# Altium project DoorController.PrjPCB
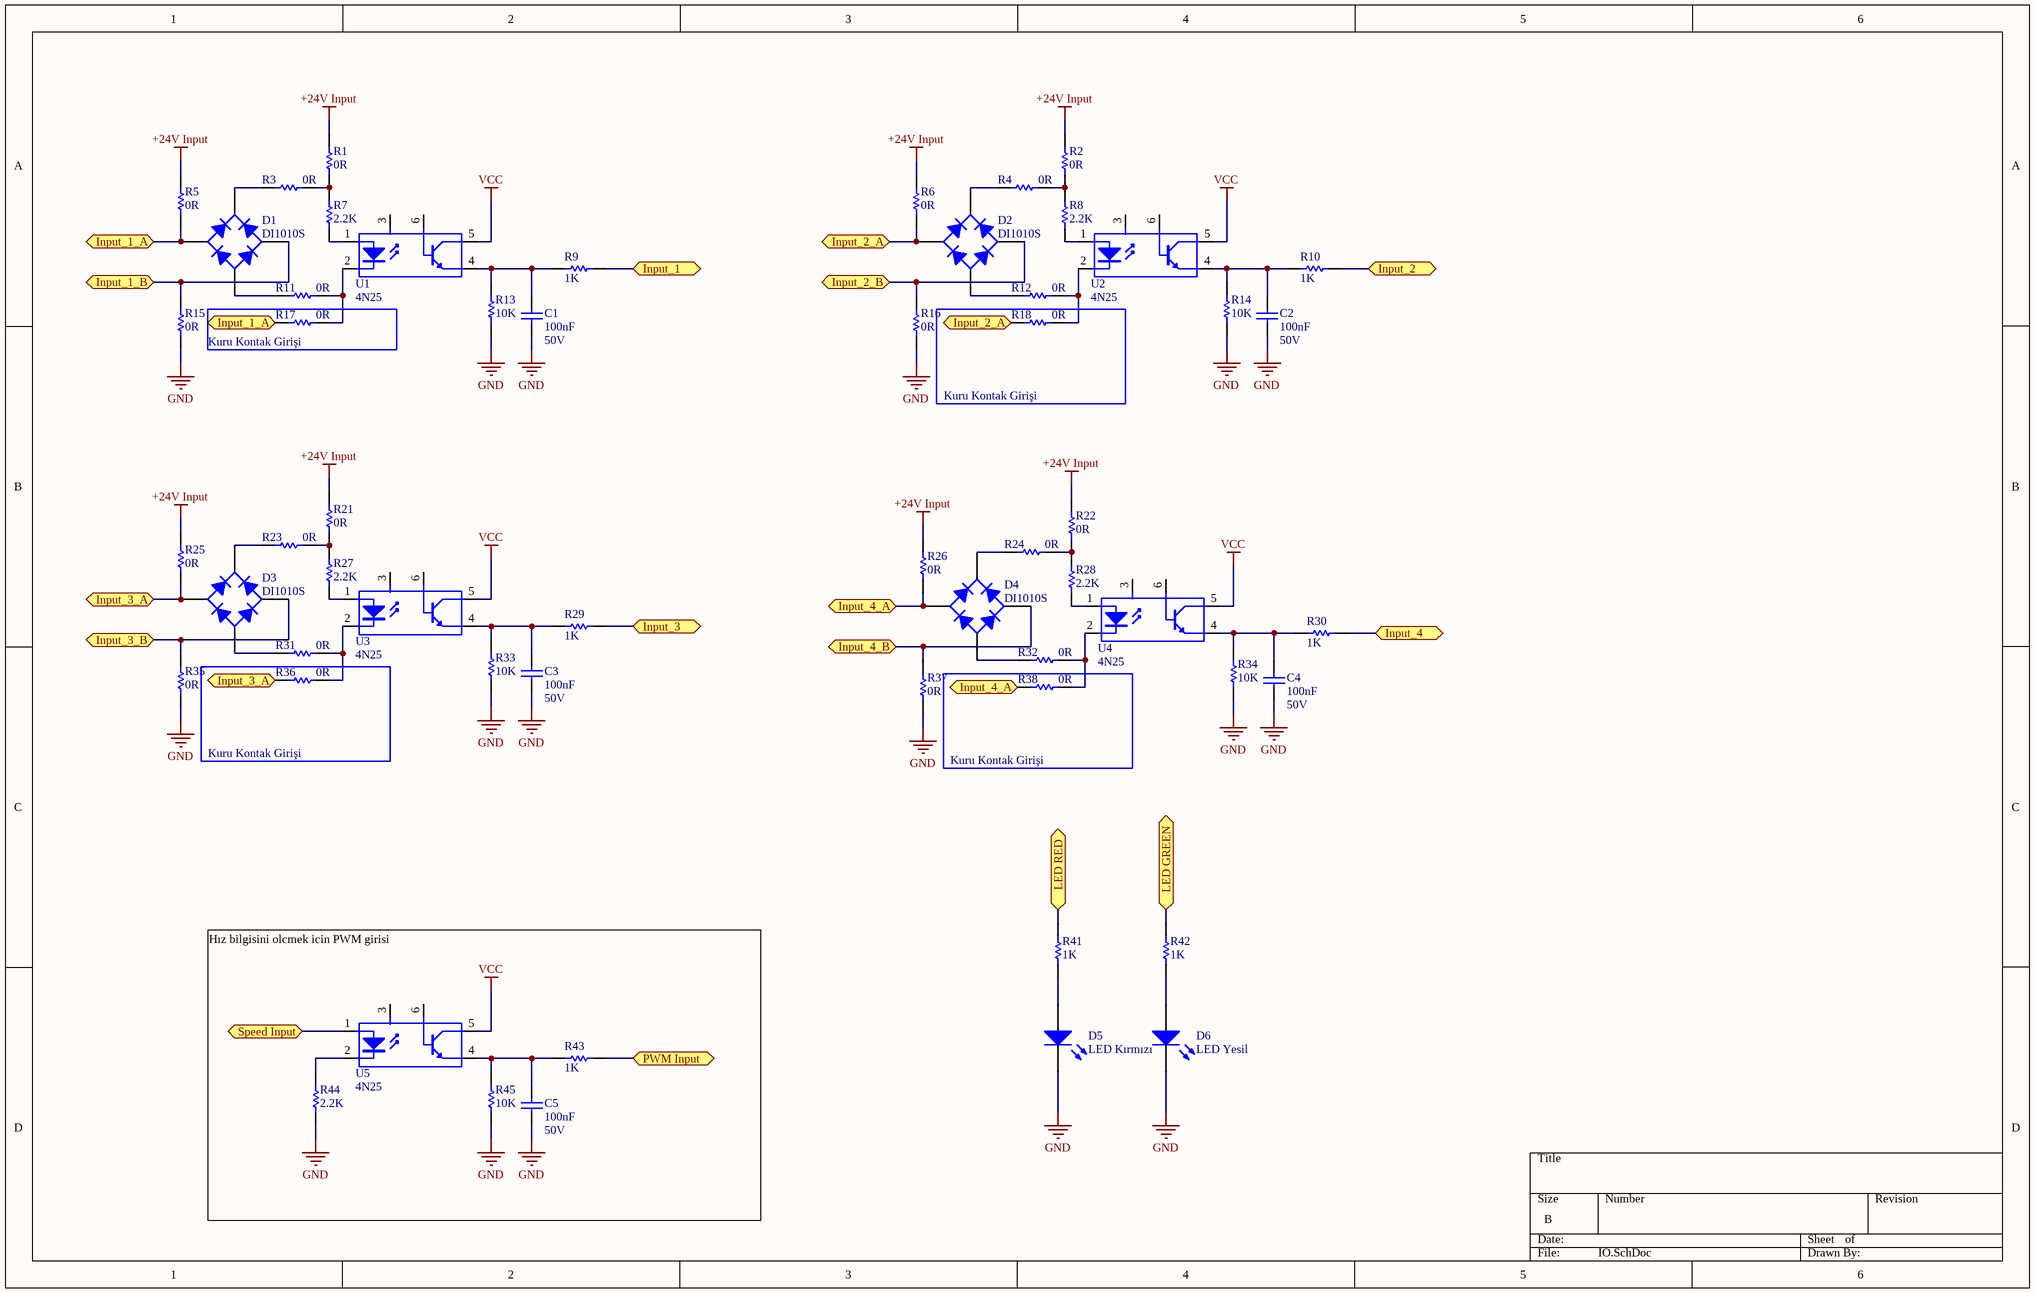
[diagram p0: IO.SchDoc]
4 sheets, 80 parts. Net scope: flat (ports and power ports of the same name join across sheets).
Board file: DoorController_DM-045_V03.PcbDoc
Sheets:
  IO.SchDoc
  Main.SchDoc
  POWER.SchDoc
  USART.SchDoc

## Sheet IO.SchDoc
size B

### Parts
C1  value 100nF  Voltage: 50V  [3-0603_L]  (hidden comment: Cap)
C2  value 100nF  Voltage: 50V  [3-0603_L]  (hidden comment: Cap)
C3  value 100nF  Voltage: 50V  [3-0603_L]  (hidden comment: Cap)
C4  value 100nF  Voltage: 50V  [3-0603_L]  (hidden comment: Cap)
C5  value 100nF  Voltage: 50V  [3-0603_L]  (hidden comment: Cap)
D1  DI1010S  [DF-S]
D2  DI1010S  [DF-S]
D3  DI1010S  [DF-S]
D4  DI1010S  [DF-S]
D5  LED Kırmızı  [6-0805 - LED]
D6  LED Yesil  [6-0805 - LED]
R1  value 0R  [6-0805_M]  (hidden comment: Res1)
R2  value 0R  [6-0805_M]  (hidden comment: Res1)
R3  value 0R  [6-0805_M]  (hidden comment: Res1)
R4  value 0R  [6-0805_M]  (hidden comment: Res1)
R5  value 0R  [6-0805_M]  (hidden comment: Res1)
R6  value 0R  [6-0805_M]  (hidden comment: Res1)
R7  value 2.2K  [6-0805_M]  (hidden comment: Res1)
R8  value 2.2K  [6-0805_M]  (hidden comment: Res1)
R9  value 1K  [3-0603_L]  (hidden comment: Res1)
R10  value 1K  [3-0603_L]  (hidden comment: Res1)
R11  value 0R  [6-0805_M]  (hidden comment: Res1)
R12  value 0R  [6-0805_M]  (hidden comment: Res1)
R13  value 10K  [3-0603_L]  (hidden comment: Res1)
R14  value 10K  [3-0603_L]  (hidden comment: Res1)
R15  value 0R  [6-0805_M]  (hidden comment: Res1)
R16  value 0R  [6-0805_M]  (hidden comment: Res1)
R17  value 0R  [6-0805_M]  (hidden comment: Res1)
R18  value 0R  [6-0805_M]  (hidden comment: Res1)
R21  value 0R  [6-0805_M]  (hidden comment: Res1)
R22  value 0R  [6-0805_M]  (hidden comment: Res1)
R23  value 0R  [6-0805_M]  (hidden comment: Res1)
R24  value 0R  [6-0805_M]  (hidden comment: Res1)
R25  value 0R  [6-0805_M]  (hidden comment: Res1)
R26  value 0R  [6-0805_M]  (hidden comment: Res1)
R27  value 2.2K  [6-0805_M]  (hidden comment: Res1)
R28  value 2.2K  [6-0805_M]  (hidden comment: Res1)
R29  value 1K  [3-0603_L]  (hidden comment: Res1)
R30  value 1K  [3-0603_L]  (hidden comment: Res1)
R31  value 0R  [6-0805_M]  (hidden comment: Res1)
R32  value 0R  [6-0805_M]  (hidden comment: Res1)
R33  value 10K  [3-0603_L]  (hidden comment: Res1)
R34  value 10K  [3-0603_L]  (hidden comment: Res1)
R35  value 0R  [6-0805_M]  (hidden comment: Res1)
R36  value 0R  [6-0805_M]  (hidden comment: Res1)
R37  value 0R  [6-0805_M]  (hidden comment: Res1)
R38  value 0R  [6-0805_M]  (hidden comment: Res1)
R41  value 1K  [3-0603_L]  (hidden comment: Res1)
R42  value 1K  [3-0603_L]  (hidden comment: Res1)
R43  value 1K  [3-0603_L]  (hidden comment: Res1)
R44  value 2.2K  [6-0805_M]  (hidden comment: Res1)
R45  value 10K  [3-0603_L]  (hidden comment: Res1)
U1  4N25  [DIP-6]
U2  4N25  [DIP-6]
U3  4N25  [DIP-6]
U4  4N25  [DIP-6]
U5  4N25  [DIP-6]

### Blocks framed on the sheet
Kuru Kontak Girişi: R17
Kuru Kontak Girişi: R18
Kuru Kontak Girişi: R36
Kuru Kontak Girişi: R38

### Ports
Input_1, Input_1_A, Input_1_B, Input_2, Input_2_A, Input_2_B, Input_3, Input_3_A, Input_3_B, Input_4, Input_4_A, Input_4_B, LED GREEN (bidir), LED RED (bidir), PWM Input, Speed Input

### Nets
+24V Input: R1.2 R2.2 R5.2 R6.2 R21.2 R22.2 R25.2 R26.2
GND: C1.2 C2.2 C3.2 C4.2 C5.2 D5.2(K) D6.2(K) R13.1 R14.1 R15.1 R16.1 R33.1 R34.1 R35.1 R37.1 R44.1 R45.1
VCC: U1.5(C) U2.5(C) U3.5(C) U4.5(C) U5.5(C)
NetC1_1: C1.1 R9.1 R13.2 U1.4(E)
NetC2_1: C2.1 R10.1 R14.2 U2.4(E)
NetC3_1: C3.1 R29.1 R33.2 U3.4(E)
NetC4_1: C4.1 R30.1 R34.2 U4.4(E)
NetC5_1: C5.1 R43.1 R45.2 U5.4(E)
NetD1_1: D1.1(A) R11.2
NetD1_2: D1.2(C) R5.1 R17.2 ; port Input_1_A
NetD1_3: D1.3(K) R3.2
NetD1_4: D1.4(C) R15.2 ; port Input_1_B
NetD2_1: D2.1(A) R12.2
NetD2_2: D2.2(C) R6.1 R18.2 ; port Input_2_A
NetD2_3: D2.3(K) R4.2
NetD2_4: D2.4(C) R16.2 ; port Input_2_B
NetD3_1: D3.1(A) R31.2
NetD3_2: D3.2(C) R25.1 R36.2 ; port Input_3_A
NetD3_3: D3.3(K) R23.2
NetD3_4: D3.4(C) R35.2 ; port Input_3_B
NetD4_1: D4.1(A) R32.2
NetD4_2: D4.2(C) R26.1 R38.2 ; port Input_4_A
NetD4_3: D4.3(K) R24.2
NetD4_4: D4.4(C) R37.2 ; port Input_4_B
NetD5_1: D5.1(A) R41.1
NetD6_1: D6.1(A) R42.1
NetR1_1: R1.1 R3.1 R7.1
NetR2_1: R2.1 R4.1 R8.1
NetR7_2: R7.2 U1.1(A)
NetR8_2: R8.2 U2.1(A)
NetR9_2: R9.2 ; port Input_1
NetR10_2: R10.2 ; port Input_2
NetR11_1: R11.1 R17.1 U1.2(K)
NetR12_1: R12.1 R18.1 U2.2(K)
NetR21_1: R21.1 R23.1 R27.1
NetR22_1: R22.1 R24.1 R28.1
NetR27_2: R27.2 U3.1(A)
NetR28_2: R28.2 U4.1(A)
NetR29_2: R29.2 ; port Input_3
NetR30_2: R30.2 ; port Input_4
NetR31_1: R31.1 R36.1 U3.2(K)
NetR32_1: R32.1 R38.1 U4.2(K)
NetR41_2: R41.2 ; port LED RED
NetR42_2: R42.2 ; port LED GREEN
NetR43_2: R43.2 ; port PWM Input
NetR44_2: R44.2 U5.2(K)
NetU5_1: U5.1(A) ; port Speed Input

Not connected (* = marked no-connect by the designer): U1 3(NC) 6(B); U2 3(NC) 6(B); U3 3(NC) 6(B); U4 3(NC) 6(B); U5 3(NC) 6(B)

### Notes on the sheet
- Hız bilgisini olcmek icin PWM girisi

### Library data of the parts
C1-C5 = Cap: Capacitor; Published: 8-Jun-2000; Revision: July-2002: Re-released for DXP Platform.; Publisher: Altium Limited
D1-D4 = DI1010S: Full Wave Diode Bridge; Published: 8-Jun-2000; Revision: July-2002: Re-released for DXP Platform.; Publisher: Altium Limited
D5 D6 = LED: Typical INFRARED GaAs LED; Published: 8-Jun-2000; LatestRevisionDate: 08-Jul-2005; LatestRevisionNote: Mech Layer 1 removed.; PackageReference: LED-0; Publisher: Altium Limited
R1-R18 R21-R38 R41-R45 = Res1: Resistor; Published: 8-Jun-2000; LatestRevisionDate: 17-Jul-2002; LatestRevisionNote: Re-released for DXP Platform.; PackageReference: AXIAL-0.3; Publisher: Altium Limited
U1-U5 = 4N25: Published: 24-Mar-1999; LatestRevisionDate: 04-Mar-2005; LatestRevisionNote: PCB Footprint replaced, Sch pins re-numbered.; DatasheetDocument: Apr-2004; PackageReference: SOP5(6); Publisher: Altium Limited

## Sheet Main.SchDoc
size A4
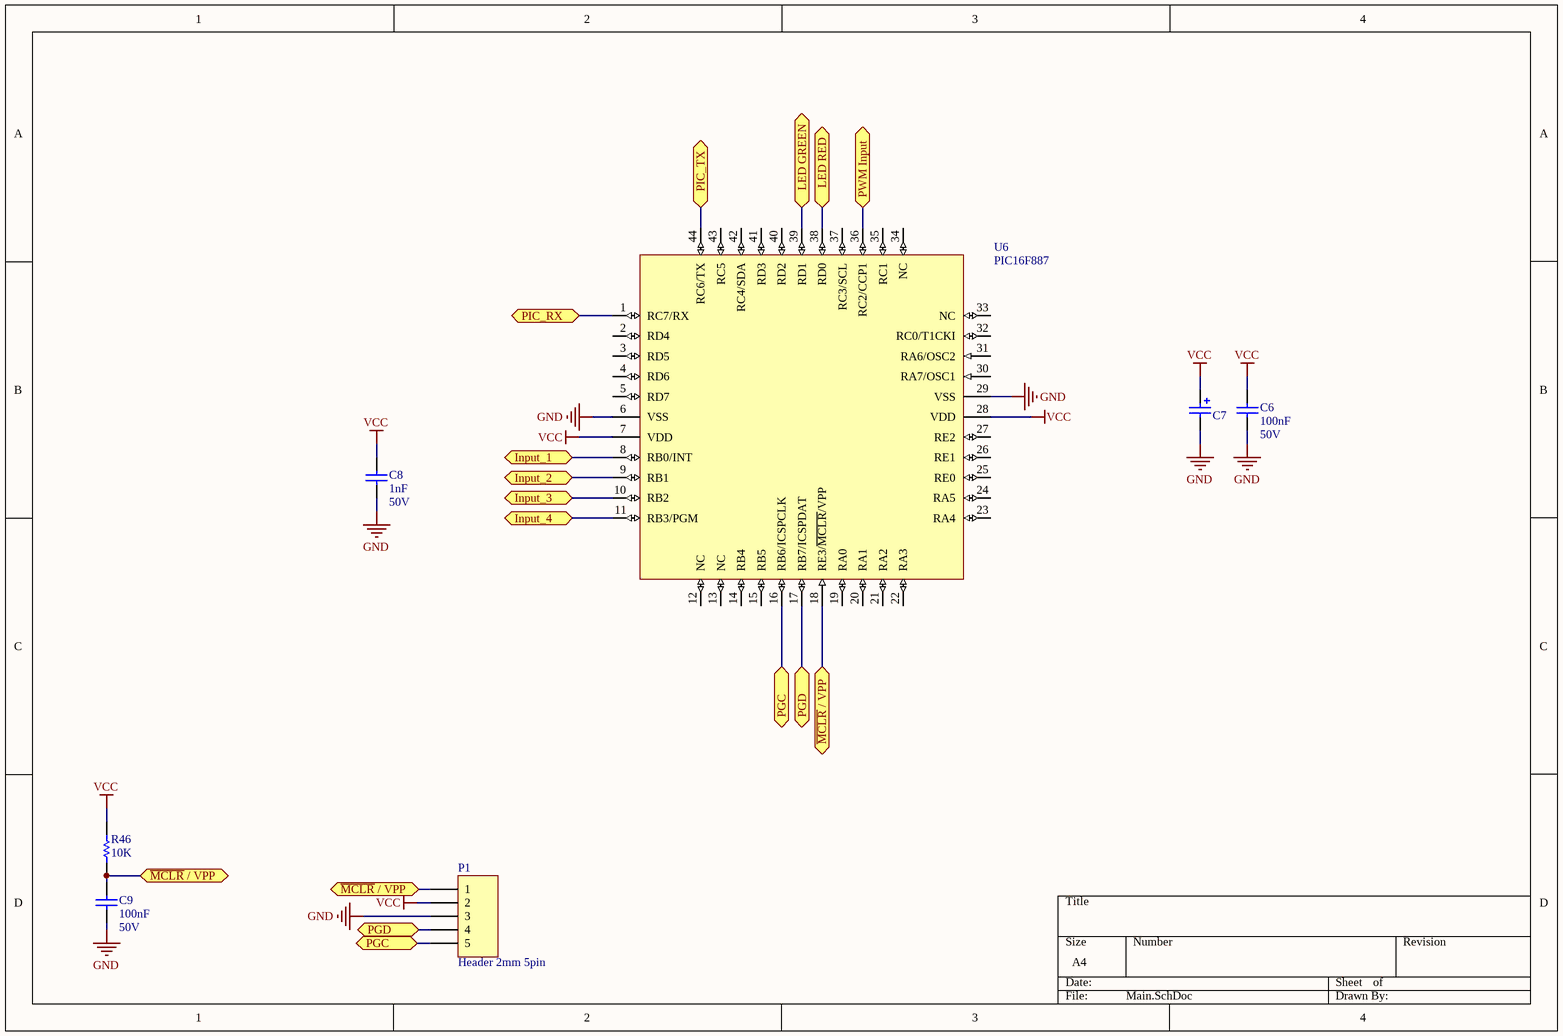
[diagram p1: Main.SchDoc]

### Parts
C6  value 100nF  Voltage: 50V  [3-0603_L]  (hidden comment: Cap)
C7  CAP-Tantal  [3528]  (value not drawn)
C8  value 1nF  Voltage: 50V  [3-0603_L]  (hidden comment: Cap)
C9  value 100nF  Voltage: 50V  [3-0603_L]  (hidden comment: Cap)
P1  Header 2mm 5pin  [Header 2mm 5Pin]
R46  value 10K  [3-0603_L]  (hidden comment: Res1)
U6  PIC16F887  [TQFP-44]

### Ports
Input_1 (bidir), Input_2 (bidir), Input_3 (bidir), Input_4 (bidir), LED GREEN (bidir), LED RED (bidir), PGC (bidir), PGD (bidir), PIC_RX (bidir), PIC_TX (bidir), PWM Input (bidir), ~{MCLR} / VPP (bidir)

### Nets
GND: C6.2 C7.2 C8.2 C9.2 P1.3 U6.6(VSS) U6.29(VSS)
VCC: C6.1 C7.1 C8.1 P1.2 R46.2 U6.7(VDD) U6.28(VDD)
NetC9_1: C9.1 P1.1 R46.1 U6.18(RE3/~{MCLR}/VPP) ; port ~{MCLR} / VPP
NetP1_4: P1.4 U6.17(RB7/ICSPDAT) ; port PGD
NetP1_5: P1.5 U6.16(RB6/ICSPCLK) ; port PGC
NetR9_2: U6.8(RB0/INT) ; port Input_1
NetR10_2: U6.9(RB1) ; port Input_2
NetR29_2: U6.10(RB2) ; port Input_3
NetR30_2: U6.11(RB3/PGM) ; port Input_4
NetR41_2: U6.38(RD0) ; port LED RED
NetR42_2: U6.39(RD1) ; port LED GREEN
NetR43_2: U6.36(RC2/CCP1) ; port PWM Input
NetU6_1: U6.1(RC7/RX) ; port PIC_RX
NetU6_44: U6.44(RC6/TX) ; port PIC_TX

Not connected (* = marked no-connect by the designer): U6 2(RD4) 3(RD5) 4(RD6) 5(RD7) 12(NC) 13(NC) 14(RB4) 15(RB5) 19(RA0) 20(RA1) 21(RA2) 22(RA3) 23(RA4) 24(RA5) 25(RE0) 26(RE1) 27(RE2) 30(RA7/OSC1) 31(RA6/OSC2) 32(RC0/T1CKI) 33(NC) 34(NC) 35(RC1) 37(RC3/SCL) 40(RD2) 41(RD3) 42(RC4/SDA) 43(RC5)

### Library data of the parts
C6 C8 C9 = Cap: Capacitor; Published: 8-Jun-2000; Revision: July-2002: Re-released for DXP Platform.; Publisher: Altium Limited
C7 = CAP-Tantal: Tantamount Military, Surface Mount MIL-PRF-55365/8 Qualified Solid Tantalum Chip Capacitor: 6.8uF, 20% Tolerance, 6 WVDC @ +85°C, Surge = 8V; Note: See Data Sheet for full range of components; Value: 22uF; Voltage: 10V; Published: 19-Mar-2004; DatasheetDocument: 20-Mar-2003; PackageReference: 3528; Publisher: Altium Limited; Code_JEITA: 3528; ComponentLink1Description: Manufacturer Link; ComponentLink1URL: http://www.vishay.com/; ComponentLink2Description: Datasheet; ComponentLink2URL: http://www.vishay.com/docs/40011/cwr11.pdf
P1 = Header 2mm 5pin: Header 2mm , 5-Pin; LatestRevisionDate: 17-Jul-2002; LatestRevisionNote: Re-released for DXP Platform.; Publisher: Altium Limited
R46 = Res1: Resistor; Published: 8-Jun-2000; LatestRevisionDate: 17-Jul-2002; LatestRevisionNote: Re-released for DXP Platform.; PackageReference: AXIAL-0.3; Publisher: Altium Limited
U6 = PIC16F887: EPROM-Based 8-Bit CMOS Microcontroller; Package Information: Latest Revision: 1998; Published: 8-Jun-2000; Revision: 17-Jul-2002: Re-released for DXP Platform.; Datasheet: Latest Revision: 1998; Package Reference: JW18; Publisher: Altium Limited

## Sheet POWER.SchDoc
size A4
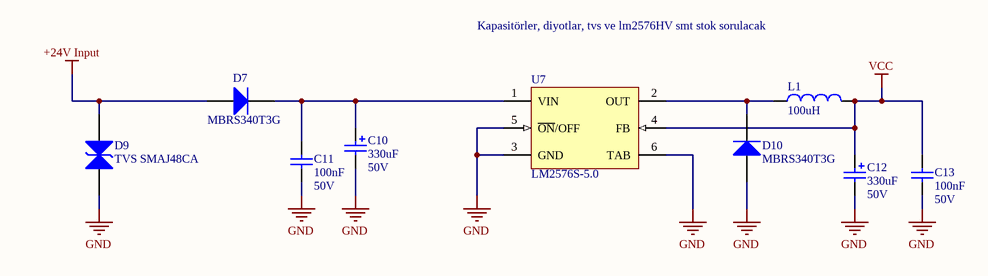
[diagram p2: POWER.SchDoc]

### Parts
C10  value 330uF  Voltage: 50V  [CAP Size H13= 12.5x13.8mm]  (hidden comment: Cap Pol1)
C11  value 100nF  Voltage: 50V  [3-0603_L]  (hidden comment: Cap)
C12  value 330uF  Voltage: 50V  [CAP Size H13= 12.5x13.8mm]  (hidden comment: Cap Pol1)
C13  value 100nF  Voltage: 50V  [3-0603_L]  (hidden comment: Cap)
D7  MBRS340T3G  [CASE 403-03 ISSUE E]
D9  TVS SMAJ48CA  [DO214 AA]
D10  MBRS340T3G  [CASE 403-03 ISSUE E]
L1  value 100uH  [EB-221M18G01]  (hidden comment: Inductor)
U7  LM2576S-5.0  [TS5B_M]

### Nets
+24V Input: D7.1(A) D9.2
GND: C10.2 C11.1 C12.2 C13.1 D9.1 D10.1(A) U7.3(GND) U7.5(~{ON}/OFF) U7.6(TAB)
VCC: C12.1 C13.2 L1.2 U7.4(FB)
NetC10_1: C10.1 C11.2 D7.2(K) U7.1(VIN)
NetD10_2: D10.2(K) L1.1 U7.2(OUT)

### Notes on the sheet
- Kapasitörler, diyotlar, tvs ve lm2576HV smt stok sorulacak

### Library data of the parts
C10 C12 = Cap Pol1: Polarized Capacitor (Radial); Published: 8-Jun-2000; Revision: July-2002: Re-released for DXP Platform.; Publisher: Altium Limited
C11 C13 = Cap: Capacitor; Published: 8-Jun-2000; Revision: July-2002: Re-released for DXP Platform.; Publisher: Altium Limited
D7 D10 = MBRS340T3G: 3 Amp Shotky Rectifier; Published: 8-Jun-2000; LatestRevisionDate: 17-Jul-2002; LatestRevisionNote: Re-released for DXP Platform.; DatasheetDocument: 1998; PackageDocument: Aug-1999; Publisher: Altium Limited; ComponentLink1Description: Manufacturer Link; ComponentLink2Description: Datasheet
L1 = Inductor: Code_IEC: 1005; Published: 8-Jun-2000; LatestRevisionDate: 17-Jul-2002; LatestRevisionNote: Re-released for DXP Platform.; PackageReference: 0402-A; Publisher: Altium Limited; Code_JEITA: 0402
U7 = LM2576S-5.0: SIMPLE SWITCHER; 3A Step-Down Voltage Regulator; Manufacturer: National Semiconductor; PackageTopMarking: NSUZXYTT*LM2576S*-5.0 P+; Published: 4-Dec-2008; PackageVersion: revD, Apr-2005; PackageReference: TS5B; Publisher: Altium Limited; PackageDescription: TO-263, Molded, .400 x .390 x .180in, 5 Lead, .067in Pitch, Surface Mount; CompType: Switcher; PartNumber: LM2576S-5.0; RoHS: O; PinCount: 5; DigiKeyPartNumber: LM2576S-5.0-ND; Code_JEDEC: MO-169-AB; ComponentLink1Description: LM2576 Datasheet; ComponentLink1URL: http://www.national.com/ds/LM/LM2576.pdf; ComponentLink2Description: LM2576 Web Page; ComponentLink2URL: http://www.national.com/pf/LM/LM2576.html; ComponentLink3Description: TS5B Package Page; ComponentLink3URL: http://www.national.com/packaging/folders/ts5b.html
D9 = TVS SMAJ48CA: Published: 8-Jun-2000; LatestRevisionDate: 17-Jul-2002; LatestRevisionNote: Re-released for DXP Platform.; DatasheetDocument: 1998; PackageDocument: Aug-1999; PackageReference: DO-41; Publisher: Altium Limited; Code_JEDEC: DO-204-AL; ComponentLink1Description: Manufacturer Link; ComponentLink1URL: http://www.fairchildsemi.com/; ComponentLink2Description: Datasheet; ComponentLink2URL: http://www.fairchildsemi.com/ds/1N%2F1N4001.pdf

## Sheet USART.SchDoc
size A4
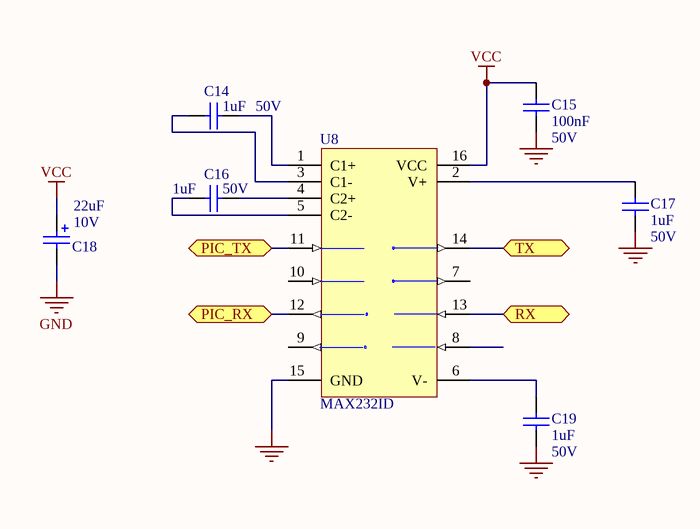
[diagram p3: USART.SchDoc]

### Parts
C14  value 1uF  Voltage: 50V  [3-0603_L]  (hidden comment: Cap)
C15  value 100nF  Voltage: 50V  [3-0603_L]  (hidden comment: Cap)
C16  value 1uF  Voltage: 50V  [3-0603_L]  (hidden comment: Cap)
C17  value 1uF  Voltage: 50V  [3-0603_L]  (hidden comment: Cap)
C18  value 22uF  Voltage: 10V  [3528]  (hidden comment: CAP-Tantal)
C19  value 1uF  Voltage: 50V  [3-0603_L]  (hidden comment: Cap)
U8  MAX232ID  [SOIC16 - big]

### Ports
PIC_RX (bidir), PIC_TX (bidir), RX (bidir), TX (bidir)

### Nets
GND: C15.1 C17.1 C18.2 C19.1 U8.15(GND)
VCC: C15.2 C18.1 U8.16(VCC)
NetC14_1: C14.1 U8.1(C1+)
NetC14_2: C14.2 U8.3(C1-)
NetC16_1: C16.1 U8.4(C2+)
NetC16_2: C16.2 U8.5(C2-)
NetC17_2: C17.2 U8.2(V+)
NetC19_2: C19.2 U8.6(V-)
NetU6_1: U8.12(R1OUT) ; port PIC_RX
NetU6_44: U8.11(T1IN) ; port PIC_TX
NetU8_13: U8.13(R1IN) ; port RX
NetU8_14: U8.14(T1OUT) ; port TX

Not connected (* = marked no-connect by the designer): U8 7(T2OUT) 8(R2IN) 9(R2OUT) 10(T2IN)

### Library data of the parts
C14-C17 C19 = Cap: Capacitor; Published: 8-Jun-2000; Revision: July-2002: Re-released for DXP Platform.; Publisher: Altium Limited
C18 = CAP-Tantal: Tantamount Military, Surface Mount MIL-PRF-55365/8 Qualified Solid Tantalum Chip Capacitor: 6.8uF, 20% Tolerance, 6 WVDC @ +85°C, Surge = 8V; Note: See Data Sheet for full range of components; Published: 19-Mar-2004; DatasheetDocument: 20-Mar-2003; PackageReference: 3528; Publisher: Altium Limited; Code_JEITA: 3528; ComponentLink1Description: Manufacturer Link; ComponentLink1URL: http://www.vishay.com/; ComponentLink2Description: Datasheet; ComponentLink2URL: http://www.vishay.com/docs/40011/cwr11.pdf
U8 = MAX232ID: 5V, Low-Power, up to 1Mbps, True RS-232 Transceiver Using Four 0.1µF External Capacitor; Code - JEDEC: MS-012-AC; Code - IPC: SO16; Published: 16-Jan-2001; Revision: 17-Jul-2002: Re-released for DXP Platform.; Datasheet: Latest Revision: Mar-1999; Package Reference: NSO16; Publisher: Altium Limited

## Nets that join several sheets
+24V Input: IO (8 pins), POWER (D7.1 D9.2)
GND: IO (17 pins), Main (7 pins), POWER (9 pins), USART (5 pins)
VCC: IO (5 pins), Main (7 pins), POWER (C12.1 C13.2 L1.2 U7.4), USART (C15.2 C18.1 U8.16)
NetR9_2: IO (R9.2), Main (U6.8)
NetR10_2: IO (R10.2), Main (U6.9)
NetR29_2: IO (R29.2), Main (U6.10)
NetR30_2: IO (R30.2), Main (U6.11)
NetR41_2: IO (R41.2), Main (U6.38)
NetR42_2: IO (R42.2), Main (U6.39)
NetR43_2: IO (R43.2), Main (U6.36)
NetU6_1: Main (U6.1), USART (U8.12)
NetU6_44: Main (U6.44), USART (U8.11)